# Altium schematic sheet eBox_Peripherals.SchDoc: eBox_Peripherals
size A4; DocumentNumber: 5; SheetNumber: 5; SheetTotal: 7
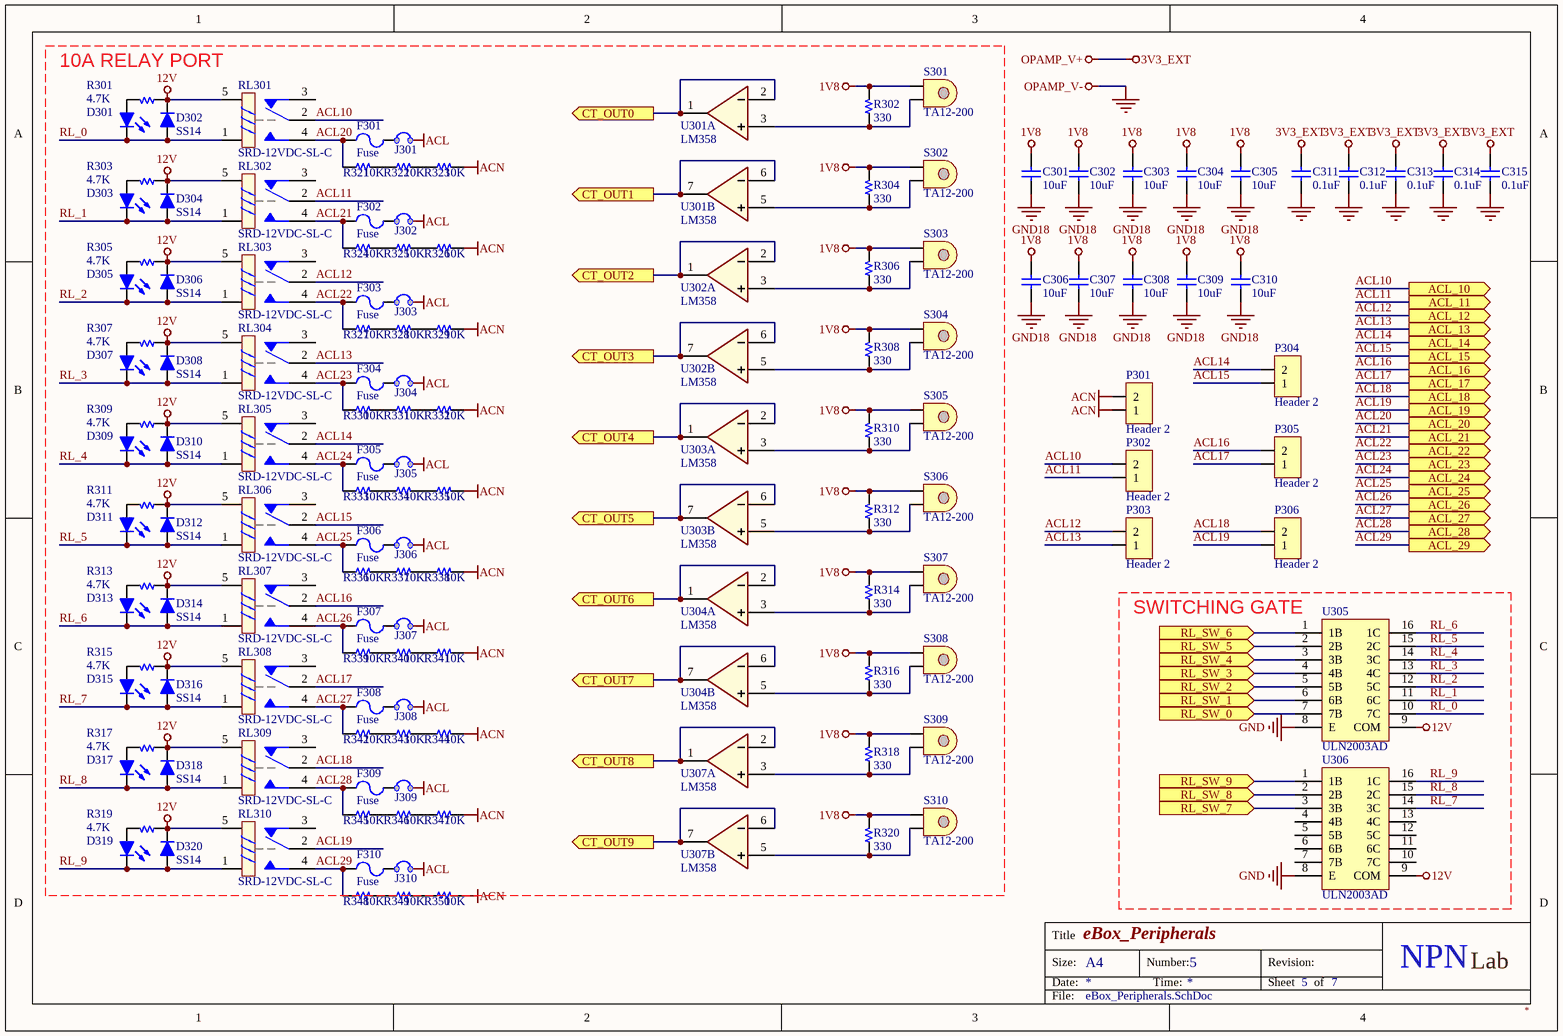
[diagram p0: eBox_Peripherals.SchDoc]

## Parts
C301  10uF  [C 0805]
C302  10uF  [C 0805]
C303  10uF  [C 0805]
C304  10uF  [C 0805]
C305  10uF  [C 0805]
C306  10uF  [C 0805]
C307  10uF  [C 0805]
C308  10uF  [C 0805]
C309  10uF  [C 0805]
C310  10uF  [C 0805]
C311  0.1uF  [C 0805]
C312  0.1uF  [C 0805]
C313  0.1uF  [C 0805]
C314  0.1uF  [C 0805]
C315  0.1uF  [C 0805]
D301  Led  [LED 3MM - green]  (value not drawn)
D302  SS14  [DO-214AC (SMA) L]
D303  Led  [LED 3MM - green]  (value not drawn)
D304  SS14  [DO-214AC (SMA) L]
D305  Led  [LED 3MM - green]  (value not drawn)
D306  SS14  [DO-214AC (SMA) L]
D307  Led  [LED 3MM - green]  (value not drawn)
D308  SS14  [DO-214AC (SMA) L]
D309  Led  [LED 3MM - green]  (value not drawn)
D310  SS14  [DO-214AC (SMA) L]
D311  Led  [LED 3MM - green]  (value not drawn)
D312  SS14  [DO-214AC (SMA) L]
D313  Led  [LED 3MM - green]  (value not drawn)
D314  SS14  [DO-214AC (SMA) L]
D315  Led  [LED 3MM - green]  (value not drawn)
D316  SS14  [DO-214AC (SMA) L]
D317  Led  [LED 3MM - green]  (value not drawn)
D318  SS14  [DO-214AC (SMA) L]
D319  Led  [LED 3MM - green]  (value not drawn)
D320  SS14  [DO-214AC (SMA) L]
F301  Fuse  [FUSE 2 DIP 0520 BOX]
F302  Fuse  [FUSE 2 DIP 0520 BOX]
F303  Fuse  [FUSE 2 DIP 0520 BOX]
F304  Fuse  [FUSE 2 DIP 0520 BOX]
F305  Fuse  [FUSE 2 DIP 0520 BOX]
F306  Fuse  [FUSE 2 DIP 0520 BOX]
F307  Fuse  [FUSE 2 DIP 0520 BOX]
F308  Fuse  [FUSE 2 DIP 0520 BOX]
F309  Fuse  [FUSE 2 DIP 0520 BOX]
F310  Fuse  [FUSE 2 DIP 0520 BOX]
J301  JUMP 2 CUSTOM  [JUMP/2/Custom]  (value not drawn)  (no BOM)
J302  JUMP 2 CUSTOM  [JUMP/2/Custom]  (value not drawn)  (no BOM)
J303  JUMP 2 CUSTOM  [JUMP/2/Custom]  (value not drawn)  (no BOM)
J304  JUMP 2 CUSTOM  [JUMP/2/Custom]  (value not drawn)  (no BOM)
J305  JUMP 2 CUSTOM  [JUMP/2/Custom]  (value not drawn)  (no BOM)
J306  JUMP 2 CUSTOM  [JUMP/2/Custom]  (value not drawn)  (no BOM)
J307  JUMP 2 CUSTOM  [JUMP/2/Custom]  (value not drawn)  (no BOM)
J308  JUMP 2 CUSTOM  [JUMP/2/Custom]  (value not drawn)  (no BOM)
J309  JUMP 2 CUSTOM  [JUMP/2/Custom]  (value not drawn)  (no BOM)
J310  JUMP 2 CUSTOM  [JUMP/2/Custom]  (value not drawn)  (no BOM)
P301  Header 2  [HDR/Terminal/2/10mm]
P302  Header 2  [HDR/Terminal/2/10mm]
P303  Header 2  [HDR/Terminal/2/10mm]
P304  Header 2  [HDR/Terminal/2/10mm]
P305  Header 2  [HDR/Terminal/2/10mm]
P306  Header 2  [HDR/Terminal/2/10mm]
R301  4.7K  [R 0805]
R302  330  [R 0805]
R303  4.7K  [R 0805]
R304  330  [R 0805]
R305  4.7K  [R 0805]
R306  330  [R 0805]
R307  4.7K  [R 0805]
R308  330  [R 0805]
R309  4.7K  [R 0805]
R310  330  [R 0805]
R311  4.7K  [R 0805]
R312  330  [R 0805]
R313  4.7K  [R 0805]
R314  330  [R 0805]
R315  4.7K  [R 0805]
R316  330  [R 0805]
R317  4.7K  [R 0805]
R318  330  [R 0805]
R319  4.7K  [R 0805]
R320  330  [R 0805]
R321  10K  [R 1206]
R322  10K  [R 1206]
R323  10K  [R 1206]
R324  10K  [R 1206]
R325  10K  [R 1206]
R326  10K  [R 1206]
R327  10K  [R 1206]
R328  10K  [R 1206]
R329  10K  [R 1206]
R330  10K  [R 1206]
R331  10K  [R 1206]
R332  10K  [R 1206]
R333  10K  [R 1206]
R334  10K  [R 1206]
R335  10K  [R 1206]
R336  10K  [R 1206]
R337  10K  [R 1206]
R338  10K  [R 1206]
R339  10K  [R 1206]
R340  10K  [R 1206]
R341  10K  [R 1206]
R342  10K  [R 1206]
R343  10K  [R 1206]
R344  10K  [R 1206]
R345  10K  [R 1206]
R346  10K  [R 1206]
R347  10K  [R 1206]
R348  10K  [R 1206]
R349  10K  [R 1206]
R350  10K  [R 1206]
RL301  SRD-12VDC-SL-C  [RL_SPDT_10A]
RL302  SRD-12VDC-SL-C  [RL_SPDT_10A]
RL303  SRD-12VDC-SL-C  [RL_SPDT_10A]
RL304  SRD-12VDC-SL-C  [RL_SPDT_10A]
RL305  SRD-12VDC-SL-C  [RL_SPDT_10A]
RL306  SRD-12VDC-SL-C  [RL_SPDT_10A]
RL307  SRD-12VDC-SL-C  [RL_SPDT_10A]
RL308  SRD-12VDC-SL-C  [RL_SPDT_10A]
RL309  SRD-12VDC-SL-C  [RL_SPDT_10A]
RL310  SRD-12VDC-SL-C  [RL_SPDT_10A]
S301  TA12-200  [TA12]
S302  TA12-200  [TA12]
S303  TA12-200  [TA12]
S304  TA12-200  [TA12]
S305  TA12-200  [TA12]
S306  TA12-200  [TA12]
S307  TA12-200  [TA12]
S308  TA12-200  [TA12]
S309  TA12-200  [TA12]
S310  TA12-200  [TA12]
U301  LM358  [SOIC-8]  (parts A,B of 2)
U302  LM358  [SOIC-8]  (parts A,B of 2)
U303  LM358  [SOIC-8]  (parts A,B of 2)
U304  LM358  [SOIC-8]  (parts A,B of 2)
U305  ULN2003AD  [SOIC-16]
U306  ULN2003AD  [SOIC-16]
U307  LM358  [SOIC-8]  (parts A,B of 2)

## Ports
ACL_10 (out), ACL_11 (out), ACL_12 (out), ACL_13 (out), ACL_14 (out), ACL_15 (out), ACL_16 (out), ACL_17 (out), ACL_18 (out), ACL_19 (out), ACL_20 (out), ACL_21 (out), ACL_22 (out), ACL_23 (out), ACL_24 (out), ACL_25 (out), ACL_26 (out), ACL_27 (out), ACL_28 (out), ACL_29 (out), CT_OUT0 (out), CT_OUT1 (out), CT_OUT2 (out), CT_OUT3 (out), CT_OUT4 (out), CT_OUT5 (out), CT_OUT6 (out), CT_OUT7 (out), CT_OUT8 (out), CT_OUT9 (out), RL_SW_0 (in), RL_SW_1 (in), RL_SW_2 (in), RL_SW_3 (in), RL_SW_4 (in), RL_SW_5 (in), RL_SW_6 (in), RL_SW_7 (in), RL_SW_8 (in), RL_SW_9 (in)

## Nets
1V8: C301.1 C302.1 C303.1 C304.1 C305.1 C306.1 C307.1 C308.1 C309.1 C310.1 R302.2 R304.2 R306.2 R308.2 R310.2 R312.2 R314.2 R316.2 R318.2 R320.2 S301.1 S302.1 S303.1 S304.1 S305.1 S306.1 S307.1 S308.1 S309.1 S310.1
3V3_EXT: C311.1 C312.1 C313.1 C314.1 C315.1 U301.8(VCC) U302.8(VCC) U303.8(VCC) U304.8(VCC) U307.8(VCC)  [also labelled OPAMP_V+]
12V: D302.2(K) D304.2(K) D306.2(K) D308.2(K) D310.2(K) D312.2(K) D314.2(K) D316.2(K) D318.2(K) D320.2(K) R301.1 R303.1 R305.1 R307.1 R309.1 R311.1 R313.1 R315.1 R317.1 R319.1 RL301.5(COIL2) RL302.5(COIL2) RL303.5(COIL2) RL304.5(COIL2) RL305.5(COIL2) RL306.5(COIL2) RL307.5(COIL2) RL308.5(COIL2) RL309.5(COIL2) RL310.5(COIL2) U305.9(COM) U306.9(COM)
ACL: J301.2 J302.2 J303.2 J304.2 J305.2 J306.2 J307.2 J308.2 J309.2 J310.2
ACN: P301.1 P301.2 R323.2 R326.2 R329.2 R332.2 R335.2 R338.2 R341.2 R344.2 R347.2 R350.2
GND: C311.2 C312.2 C313.2 C314.2 C315.2 U301.4(GND) U302.4(GND) U303.4(GND) U304.4(GND) U305.8(E) U306.8(E) U307.4(GND)  [also labelled OPAMP_V-]
GND18: C301.2 C302.2 C303.2 C304.2 C305.2 C306.2 C307.2 C308.2 C309.2 C310.2
ACL10: P302.2 RL301.2(NO) ; port ACL_10
ACL11: P302.1 RL302.2(NO) ; port ACL_11
ACL12: P303.2 RL303.2(NO) ; port ACL_12
ACL13: P303.1 RL304.2(NO) ; port ACL_13
ACL14: P304.2 RL305.2(NO) ; port ACL_14
ACL15: P304.1 RL306.2(NO) ; port ACL_15
ACL16: P305.2 RL307.2(NO) ; port ACL_16
ACL17: P305.1 RL308.2(NO) ; port ACL_17
ACL18: P306.2 RL309.2(NO) ; port ACL_18
ACL19: P306.1 RL310.2(NO) ; port ACL_19
ACL20: F301.1 R321.1 RL301.4(COM) ; port ACL_20
ACL21: F302.1 R324.1 RL302.4(COM) ; port ACL_21
ACL22: F303.1 R327.1 RL303.4(COM) ; port ACL_22
ACL23: F304.1 R330.1 RL304.4(COM) ; port ACL_23
ACL24: F305.1 R333.1 RL305.4(COM) ; port ACL_24
ACL25: F306.1 R336.1 RL306.4(COM) ; port ACL_25
ACL26: F307.1 R339.1 RL307.4(COM) ; port ACL_26
ACL27: F308.1 R342.1 RL308.4(COM) ; port ACL_27
ACL28: F309.1 R345.1 RL309.4(COM) ; port ACL_28
ACL29: F310.1 R348.1 RL310.4(COM) ; port ACL_29
CT_OUT0: U301.1(OutA) U301.2(A-) ; port CT_OUT0
CT_OUT1: U301.6(B-) U301.7(OutB) ; port CT_OUT1
CT_OUT2: U302.1(OutA) U302.2(A-) ; port CT_OUT2
CT_OUT3: U302.6(B-) U302.7(OutB) ; port CT_OUT3
CT_OUT4: U303.1(OutA) U303.2(A-) ; port CT_OUT4
CT_OUT5: U303.6(B-) U303.7(OutB) ; port CT_OUT5
CT_OUT6: U304.1(OutA) U304.2(A-) ; port CT_OUT6
CT_OUT7: U304.6(B-) U304.7(OutB) ; port CT_OUT7
CT_OUT8: U307.1(OutA) U307.2(A-) ; port CT_OUT8
CT_OUT9: U307.6(B-) U307.7(OutB) ; port CT_OUT9
RL_0: D301.2(K) D302.1(A) RL301.1(COIL1) U305.10(7C)
RL_1: D303.2(K) D304.1(A) RL302.1(COIL1) U305.11(6C)
RL_2: D305.2(K) D306.1(A) RL303.1(COIL1) U305.12(5C)
RL_3: D307.2(K) D308.1(A) RL304.1(COIL1) U305.13(4C)
RL_4: D309.2(K) D310.1(A) RL305.1(COIL1) U305.14(3C)
RL_5: D311.2(K) D312.1(A) RL306.1(COIL1) U305.15(2C)
RL_6: D313.2(K) D314.1(A) RL307.1(COIL1) U305.16(1C)
RL_7: D315.2(K) D316.1(A) RL308.1(COIL1) U306.14(3C)
RL_8: D317.2(K) D318.1(A) RL309.1(COIL1) U306.15(2C)
RL_9: D319.2(K) D320.1(A) RL310.1(COIL1) U306.16(1C)
RL_SW_0: U305.7(7B) ; port RL_SW_0
RL_SW_1: U305.6(6B) ; port RL_SW_1
RL_SW_2: U305.5(5B) ; port RL_SW_2
RL_SW_3: U305.4(4B) ; port RL_SW_3
RL_SW_4: U305.3(3B) ; port RL_SW_4
RL_SW_5: U305.2(2B) ; port RL_SW_5
RL_SW_6: U305.1(1B) ; port RL_SW_6
RL_SW_7: U306.3(3B) ; port RL_SW_7
RL_SW_8: U306.2(2B) ; port RL_SW_8
RL_SW_9: U306.1(1B) ; port RL_SW_9
NetD301_1: D301.1(A) R301.2
NetD303_1: D303.1(A) R303.2
NetD305_1: D305.1(A) R305.2
NetD307_1: D307.1(A) R307.2
NetD309_1: D309.1(A) R309.2
NetD311_1: D311.1(A) R311.2
NetD313_1: D313.1(A) R313.2
NetD315_1: D315.1(A) R315.2
NetD317_1: D317.1(A) R317.2
NetD319_1: D319.1(A) R319.2
NetF301_2: F301.2 J301.1
NetF302_2: F302.2 J302.1
NetF303_2: F303.2 J303.1
NetF304_2: F304.2 J304.1
NetF305_2: F305.2 J305.1
NetF306_2: F306.2 J306.1
NetF307_2: F307.2 J307.1
NetF308_2: F308.2 J308.1
NetF309_2: F309.2 J309.1
NetF310_2: F310.2 J310.1
NetR302_1: R302.1 S301.2 U301.3(A+)
NetR304_1: R304.1 S302.2 U301.5(B+)
NetR306_1: R306.1 S303.2 U302.3(A+)
NetR308_1: R308.1 S304.2 U302.5(B+)
NetR310_1: R310.1 S305.2 U303.3(A+)
NetR312_1: R312.1 S306.2 U303.5(B+)
NetR314_1: R314.1 S307.2 U304.3(A+)
NetR316_1: R316.1 S308.2 U304.5(B+)
NetR318_1: R318.1 S309.2 U307.3(A+)
NetR320_1: R320.1 S310.2 U307.5(B+)
NetR321_2: R321.2 R322.1
NetR322_2: R322.2 R323.1
NetR324_2: R324.2 R325.1
NetR325_2: R325.2 R326.1
NetR327_2: R327.2 R328.1
NetR328_2: R328.2 R329.1
NetR330_2: R330.2 R331.1
NetR331_2: R331.2 R332.1
NetR333_2: R333.2 R334.1
NetR334_2: R334.2 R335.1
NetR336_2: R336.2 R337.1
NetR337_2: R337.2 R338.1
NetR339_2: R339.2 R340.1
NetR340_2: R340.2 R341.1
NetR342_2: R342.2 R343.1
NetR343_2: R343.2 R344.1
NetR345_2: R345.2 R346.1
NetR346_2: R346.2 R347.1
NetR348_2: R348.2 R349.1
NetR349_2: R349.2 R350.1

Not connected (* = marked no-connect by the designer): RL301 3(NC); RL302 3(NC); RL303 3(NC); RL304 3(NC); RL305 3(NC); RL306 3(NC); RL307 3(NC); RL308 3(NC); RL309 3(NC); RL310 3(NC); U306 4(4B) 5(5B) 6(6B) 7(7B) 10(7C) 11(6C) 12(5C) 13(4C)

## Notes on the sheet
- 10A RELAY PORT
- SWITCHING GATE
- Title
- Size:
- Date:
- A4
- Number:
- Time:
- Revision:
- Sheet
- of
- NPN
- Lab
- File:

## Library data of the parts
C301-C310 = Capacitor NP: Capacitor non-pol
C311-C315 = Capacitor NP: CAP CER 0.1UF 50V X7R 0805; TYPE: SMD; PACKAGE: SMD0805; STOCK CODE: CL21B104KBNC; SUPPLIER: tme.vn; STOCK DESC: 100nF/50V ±10% X7R SMD-0805 Capacitor; UNIT PRICE: 500
D301 D303 D305 D307 D309 D311 D313 D315 D317 D319 = Led: LED RED CLEAR 0805 SMD; PACKAGE: SMD0805; STOCK CODE: HT17-2102SURC; SUPPLIER: tme.vn; TYPE: SMD; STOCK DESC: SMD-0805 High Bright Red Chip LED; UNIT PRICE: 800
D302 D304 D306 D308 D310 D312 D314 D316 D318 D320 = Diode: DIODE SCHOTTKY 40V 1A SMA; BRAND: Toshiba; TYPE: SMD; PACKAGE: DO-214AC; PART NO: SS14; STOCK CODE: SS14; SUPPLIER: tme.vn; STOCK DESC: 1A 40V Schottky Barrier Diode; UNIT PRICE: 1000
P301-P306 = Header 2: Header, 2-Pin; UNIT PRICE: 0
R301 R303 R305 R307 R309 R311 R313 R315 R317 R319 = Resistor: RES SMD 4.7K OHM 1% 1/10W 0805; PACKAGE: SMD0805; STOCK CODE: RM10JTN472; SUPPLIER: tme.vn; TYPE: SMD; STOCK DESC: 4.7K 5% SMD-0805 Resistor; UNIT PRICE: 60
R302 R304 R306 R308 R310 R312 R314 R316 R318 R320 = Resistor: RES SMD 680 OHM 1% 1/10W 0805; PACKAGE: SMD0805; STOCK CODE: RM10JTN681; SUPPLIER: tme.vn; TYPE: SMD; STOCK DESC: 680R 5% SMD-0805 Resistor; UNIT PRICE: 60
R321-R350 = Resistor
RL301-RL310 = Relay SPDT: RELAY GEN PURPOSE SPDT 10A 12V; BRAND: SONGLE; PART NO: SRD-12VDC-SL-C; STOCK CODE: SRD-12VDC-SL-C; SUPPLIER: tme.vn; TYPE: TH; STOCK DESC: Relay SRD-12VDC-SL-C; UNIT PRICE: 10000
S301-S310 = TA12: CURR SENSE 1:2000 5A T/H; BRAND: YHDC; PART NO: TA12-200; SUPPLIER: CHINA; TYPE: TH; UNIT PRICE: 22328
U301-U304 U307 = LM358: Low Power Dual Operational Amplifiers
U305 U306 = ULN2003: IC PWR RELAY 7NPN 1:1 16SOIC; BRAND: Texas Instruments; PACKAGE: SOIC-16; PART NO: ULN2003AD; STOCK CODE: ULN2003AD; SUPPLIER: tme.vn; TYPE: SMD; STOCK DESC: TRANS 7 NPN DARL 50V 500MA 16SO; UNIT PRICE: 5000
F301-F310 = Fuse: UNIT PRICE: 0
J301-J310 = JUMP 2 CUSTOM: TYPE: NO-BOM; UNIT PRICE: 0